# EAGLE design GPS_radiologger_v25_LG77L_CMWX (EAGLE 9.6.2)
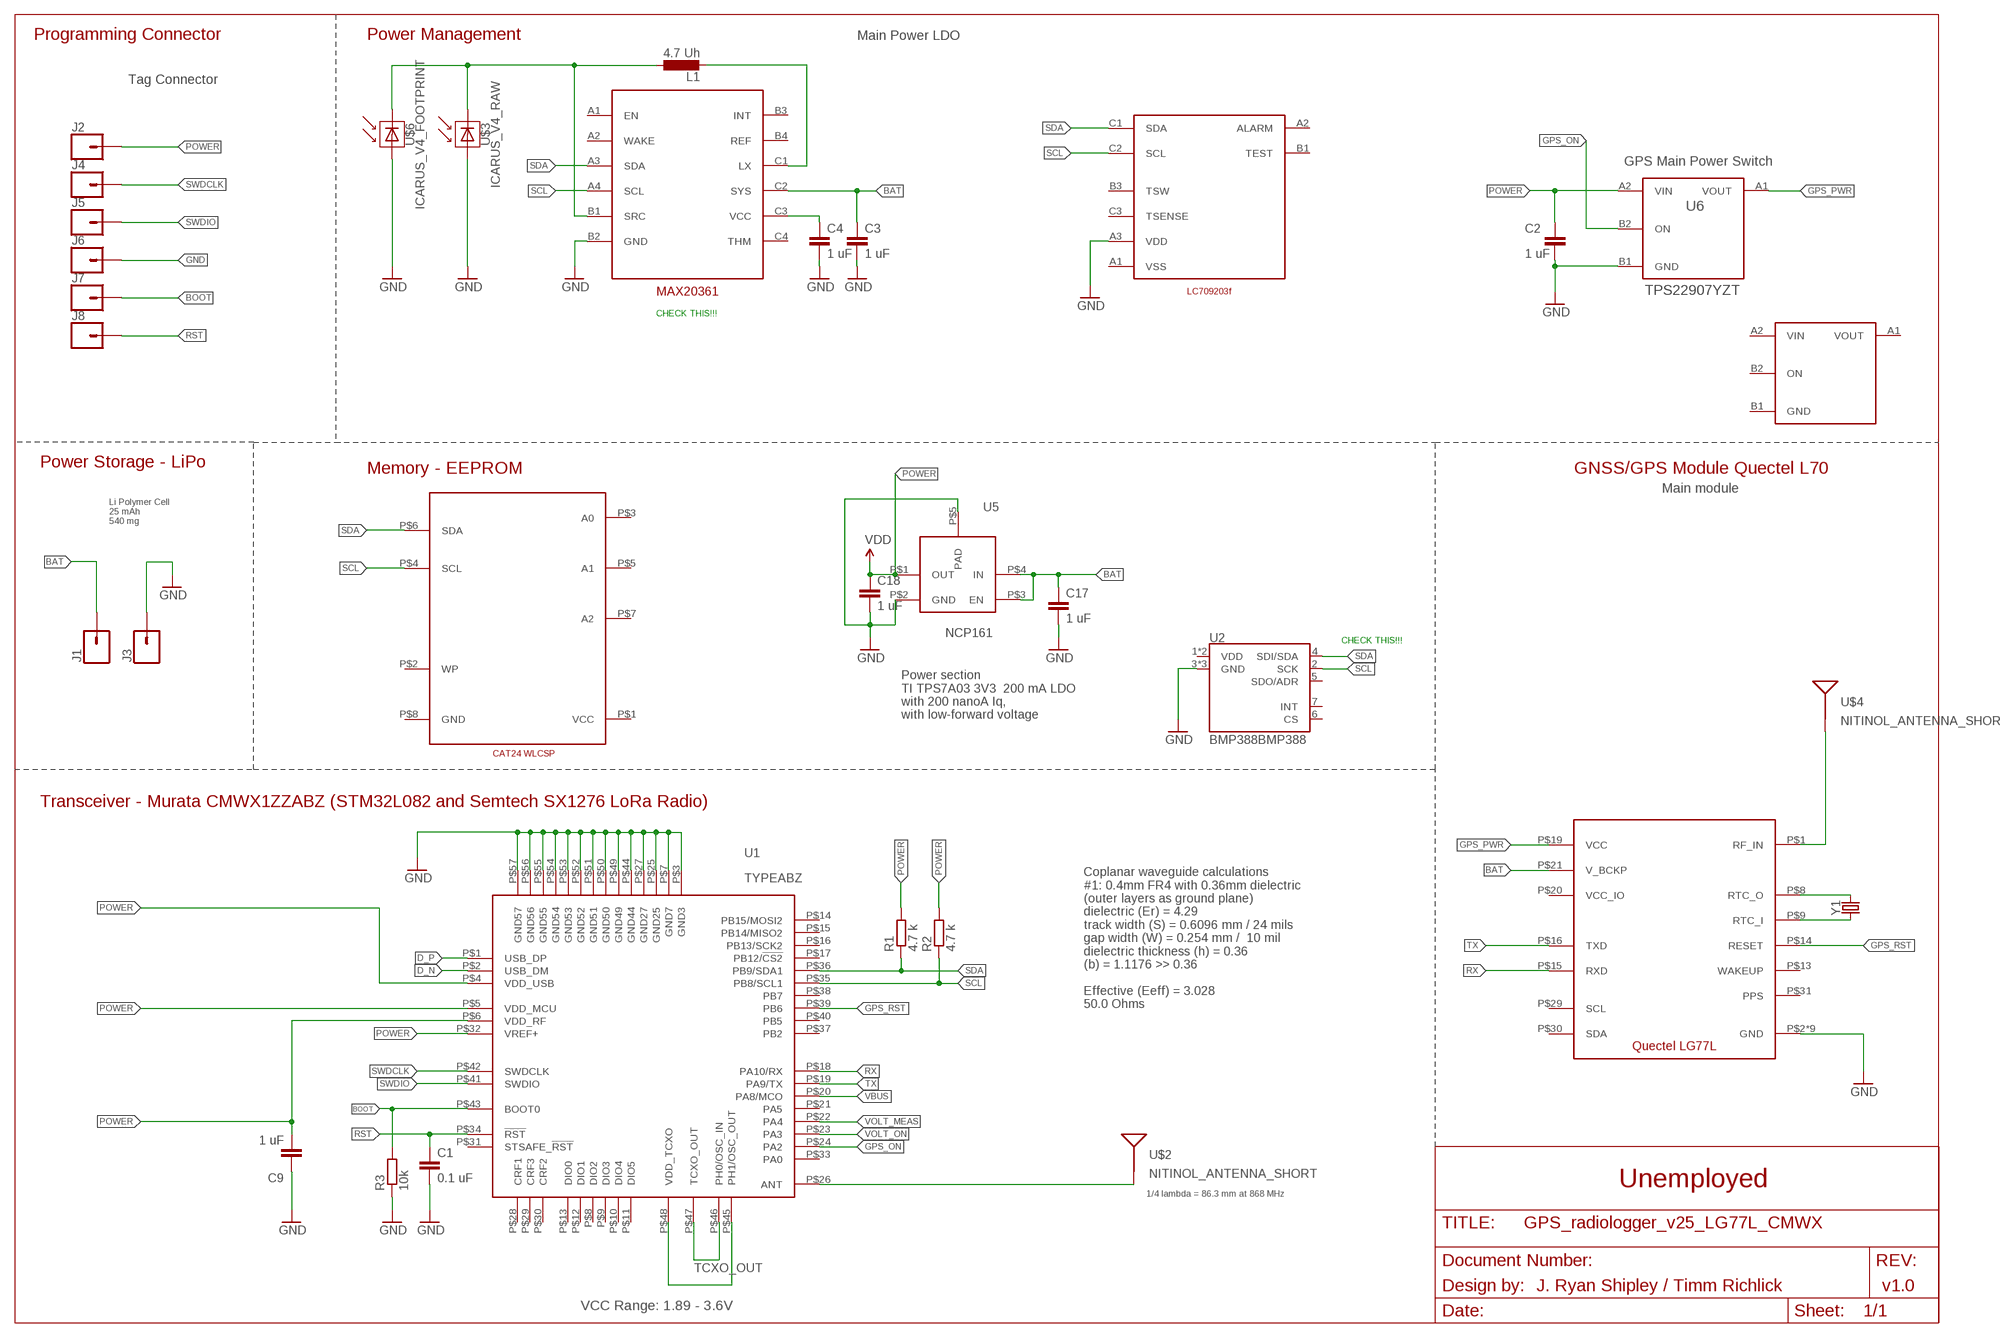
[diagram p0: schematic, sheet 1]

## Parts
C1  0.1 uF  C-EUC0201  [C0201]
C2  1 uF  C-EUC0201  [C0201]
C3  1 uF  C-EUC0201  [C0201]
C4  1 uF  C-EUC0201  [C0201]
C9  1 uF  C-EUC0201  [C0201]
C17  1 uF  0402CAP.KW  [0402-CAP]
C18  1 uF  0402CAP.KW  [0402-CAP]
J1  CONN_01PTH_NO_SILK_SMALL  [1X01_SMALL]
J2  CONN_01PTH_NO_SILK_SMALL  [1X01_SMALL]
J3  CONN_01PTH_NO_SILK_SMALL  [1X01_SMALL]
J4  CONN_01PTH_NO_SILK_SMALL  [1X01_SMALL]
J5  CONN_01PTH_NO_SILK_SMALL  [1X01_SMALL]
J6  CONN_01PTH_NO_SILK_SMALL  [1X01_SMALL]
J7  CONN_01PTH_NO_SILK_SMALL  [1X01_SMALL]
J8  CONN_01PTH_NO_SILK_SMALL  [1X01_SMALL]
L1  4.7 Uh  L-EUL2012C  [L2012C]
R1  4.7 k  R-EU_R0201  [R0201]
R2  4.7 k  R-EU_R0201  [R0201]
R3  10k  R-EU_R0201  [R0201]
U1  TYPEABZ  [TYPEABZ]
U2  BMP388BMP388  [LGA-10(2X2)]
U5  NCP161  [NCP161]
U6  TPS22907YZT  [YFP0004-DSBGA]
U$1  MAX20361  [BGA12N40P4X3_123X163X64N]
U$2  NITINOL_ANTENNA_SHORT  [ICARUS_NITINOL_ANTENNA_SHORT]
U$3  ICARUS_V4_RAW  [ICARUS_FULL_TOP]
U$4  NITINOL_ANTENNA_SHORT  [ICARUS_NITINOL_ANTENNA_SHORT]
U$5  CAT24_WLCSP8  [WLCSP8]
U$6  ICARUS_V4_FOOTPRINT  [ICARUS_FULL_FOOTPRINT]
U$7  LG77L  [LG77L]
U$8  LC709203F  [BGA9N50P3X3_160X175X50N]
U$9  TPS22916CL  [YFP0004-DSBGA]
Y1  CRYSTAL-32.768KHZ  [CRYSTAL-SMD-1.0X1.2MM]

## Nets
BAT [battery]: C3.1 C17.1 J1.P$1 U5.P$3(EN) U5.P$4(IN) U$1.C2(SYS) U$7.P$21(V_BCKP)
BOOT: J7.P$1 R3.2 U1.P$43(BOOT0)
D_N [diff_pair]: U1.P$2(USB_DM)
D_P [diff_pair]: U1.P$1(USB_DP)
GND: C1.2 C2.2 C3.2 C4.2 C9.1 C17.2 C18.2 J3.P$1 J6.P$1 R3.1 U1.P$3(GND3) U1.P$7(GND7) U1.P$25(GND25) U1.P$27(GND27) U1.P$44(GND44) U1.P$49(GND49) U1.P$50(GND50) U1.P$51(GND51) U1.P$52(GND52) U1.P$53(GND53) U1.P$54(GND54) U1.P$55(GND55) U1.P$56(GND56) U1.P$57(GND57) U2.3(GND) U2.8(GND) U2.9(GND) U5.P$2(GND) U5.P$5(PAD) U6.B1(GND) U$1.B2(GND) U$3.P$2(MINUS) U$6.P$2(MINUS) U$7.P$2(GND) U$7.P$18(GND) U$7.P$37(GND) U$7.P$38(GND) U$7.P$39(GND) U$7.P$40(GND) U$7.P$41(GND) U$7.P$42(GND) U$7.P$43(GND) U$8.A3(VDD)
GPS_ON: U1.P$24(PA2) U6.B2(ON)
GPS_PWR: U6.A1(VOUT) U$7.P$19(VCC)
GPS_RST: U1.P$39(PB6) U$7.P$14(RESET)
N$1: U1.P$45(PH1/OSC_OUT) U1.P$48(VDD_TCXO)
N$2 [antenna]: U$4.1(SIGNAL) U$4.2(SIGNAL) U$4.3(SIGNAL) U$7.P$1(RF_IN)
N$3: U$7.P$8(RTC_O) Y1.P$2
N$4: U$7.P$9(RTC_I) Y1.P$1
N$5: L1.2 U$1.C1(LX)
N$6: C4.1 U$1.C3(VCC)
N$11 [antenna]: U1.P$26(ANT) U$2.1(SIGNAL) U$2.2(SIGNAL) U$2.3(SIGNAL)
POWER [power]: C2.1 C9.2 C18.1 J2.P$1 R1.2 R2.2 U1.P$4(VDD_USB) U1.P$5(VDD_MCU) U1.P$6(VDD_RF) U1.P$32(VREF+) U5.P$1(OUT) U6.A2(VIN) ; supply symbol labelled VDD
RST: C1.1 J8.P$1 U1.P$34(!RST)
RX: U1.P$18(PA10/RX) U$7.P$15(RXD)
SCL: R2.1 U1.P$35(PB8/SCL1) U2.2(SCK) U$1.A4(SCL) U$5.P$4(SCL) U$8.C2(SCL)
SDA: R1.1 U1.P$36(PB9/SDA1) U2.4(SDI/SDA) U$1.A3(SDA) U$5.P$6(SDA) U$8.C1(SDA)
SOL_IN [battery]: L1.1 U$1.B1(SRC) U$3.P$1(PLUS) U$6.P$1(PLUS)
SWDCLK: J4.P$1 U1.P$42(SWDCLK)
SWDIO: J5.P$1 U1.P$41(SWDIO)
TCXO_OUT: U1.P$46(PH0/OSC_IN) U1.P$47(TCXO_OUT)
TX: U1.P$19(PA9/TX) U$7.P$16(TXD)
VBUS: U1.P$20(PA8/MCO)
VOLT_MEAS: U1.P$22(PA4)
VOLT_ON: U1.P$23(PA3)
Unconnected: U1.P$8(DIO2) U1.P$9(DIO3) U1.P$10(DIO4) U1.P$11(DIO5) U1.P$12(DIO1) U1.P$13(DIO0) U1.P$14(PB15/MOSI2) U1.P$15(PB14/MISO2) U1.P$16(PB13/SCK2) U1.P$17(PB12/!CS2) U1.P$21(PA5) U1.P$28(CRF1) U1.P$29(CRF3) U1.P$30(CRF2) U1.P$31(STSAFE_!RST) U1.P$33(PA0) U1.P$37(PB2) U1.P$38(PB7) U1.P$40(PB5) U2.1(VDD) U2.5(SDO/ADR) U2.6(CS) U2.7(INT) U2.10(VDD) U$1.A1(EN) U$1.A2(WAKE) U$1.B3(INT) U$1.B4(REF) U$1.C4(THM) U$5.P$1(VCC) U$5.P$2(WP) U$5.P$3(A0) U$5.P$5(A1) U$5.P$7(A2) U$5.P$8(GND) U$7.P$13(WAKEUP) U$7.P$20(VCC_IO) U$7.P$29(SCL) U$7.P$30(SDA) U$7.P$31(PPS) U$8.A1(VSS) U$8.A2(ALARM) U$8.B1(TEST) U$8.B3(TSW) U$8.C3(TSENSE) U$9.A1(VOUT) U$9.A2(VIN) U$9.B1(GND) U$9.B2(ON)

## Notes on the sheet
- Programming Connector | Power Management | Main Power LDO
- Tag Connector
- GPS Main Power Switch
- CHECK THIS!!!
- Power Storage - LiPo
- Memory - EEPROM | GNSS/GPS Module Quectel L70
- Main module
- Li Polymer Cell
  25 mAh
  540 mg
- CHECK THIS!!!
- Power section
  TI TPS7A03 3V3  200 mA LDO
  with 200 nanoA Iq, 
  with low-forward voltage
- Transceiver - Murata CMWX1ZZABZ (STM32L082 and Semtech SX1276 LoRa Radio)
- Coplanar waveguide calculations
  #1: 0.4mm FR4 with 0.36mm dielectric 
  (outer layers as ground plane)
  dielectric (Er) = 4.29
  track width (S) = 0.6096 mm / 24 mils
  gap width (W) = 0.254 mm /  10 mil
  dielectric thickness (h) = 0.36
  (b) = 1.1176 >> 0.36
  
  Effective (Eeff) = 3.028
  50.0 Ohms
- Unemployed
- 1/4 lambda = 86.3 mm at 868 MHz
- Design by: | J. Ryan Shipley / Timm Richlick | v1.0
- VCC Range: 1.89 - 3.6V

## Library data of the parts
C1-C4 C9 = rcl:C-EU: CAPACITOR, European symbol; SPICEPREFIX: C
C17 C18 = SparkFun-Capacitors:0402CAP.KW
J1-J8 = SparkFun-Connectors:CONN_01: Single connection point. Often used as Generic Header-pin footprint for 0.1 inch spaced/style header connections On any of the 0.1 inch spaced packages, you can populate with these: Break Away Headers - Straight <https://www.sparkfun.com/products/116> (PRT-00116) Break Away Male Headers - Right Angle <https://www.sparkfun.com/products/553> (PRT-00553) Female Headers <https://www.sparkfun.com/products/115> (PRT-00115) Break Away Headers - Machine Pin <https://www.sparkfun.com/products/117> (PRT-00117) Break Away Female Headers - Swiss Machine Pin <https://www.sparkfun.com/products/743> (PRT-00743) This device is also useful as a general connection point to wire up your design to another part of your project. Our various solder wires solder well into these plated through hole pads. Hook-Up Wire - Assortment (Stranded, 22 AWG) <https://www.sparkfun.com/products/11375> (PRT-11375) Hook-Up Wire - Assortment (Solid Core, 22 AWG) <https://www.sparkfun.com/products/11367> (PRT-11367) View the entire wire category on our website here <https://www.sparkfun.com/categories/141> Special notes: SMTSO-256-ET is a "flush mount" nut for a 4-40 screw. We mostly use this on specialty testbeds; it is a nice way to connect hardware to your PCB at an adjustable hieght. Also note, the SNAP packages are for using a snappable style connector. We sell a baggie of snaps and they are also used on two LilyPad designs: Snap Assortment - 30 pack (male and female) <https://www.sparkfun.com/products/11347> (DEV-11347) LilyPad Arduino SimpleSnap <https://www.sparkfun.com/products/10941> (DEV-10941) LilyPad SimpleSnap Protoboard <https://www.sparkfun.com/products/10940> (DEV-10940)
L1 = rcl:L-EU: INDUCTOR, European symbol; SPICEPREFIX: L
R1-R3 = rcl:R-EU_: RESISTOR, European symbol; SPICEPREFIX: R
U1 = Kris:TYPEABZ: CMWX1ZZABZ-078
U2 = SparkFun-Sensors:BMP388: Bosch BMP3388 Pressure Sensor Senses pressure from 300 hPa to 1250 hPa, sends data out over I2C or Serial; PROD_ID: IC-14045
U5 = Kris:NCP161: NCP161 3V3 LDO voltage regulator
U6 = TPS22916:TPS22907YZT
U$1 = Ryan_custom:MAX20361
U$2 U$4 = Antenna_mounts:NITINOL_ANTENNA_SHORT
U$3 = TrisolX_Solar_Cells:ICARUS_V4_RAW
U$5 = Ryan_custom:CAT24_WLCSP8
U$6 = TrisolX_Solar_Cells:ICARUS_V4_FOOTPRINT
U$7 = Quectel:LG77L
U$8 = Ryan_custom:LC709203F
U$9 = TPS22916:TPS22916CL
Y1 = SparkFun-Clocks:CRYSTAL-32.768KHZ: 32.768kHz Crystal Frequency: 32.768kHz Frequency Stability: ±20ppm Load Capacitance: 12.5pF (PTH-2X6 & SMD-3.2X1.5), 6pF (SMD-2X6) SparkFun Products: SparkFun BigTime Watch Kit <https://www.sparkfun.com/products/11734> SparkFun nRF52832 Breakout <https://www.sparkfun.com/products/13990> SparkFun Real Time Clock Module <https://www.sparkfun.com/products/12708>

## Net classes
1 power: width 0.152 mm
2 antenna: width 0.254 mm, clearance 0.102 mm
3 battery: width 0.152 mm
4 diff_pair: width 0.178 mm, clearance 0.152 mm

## Board
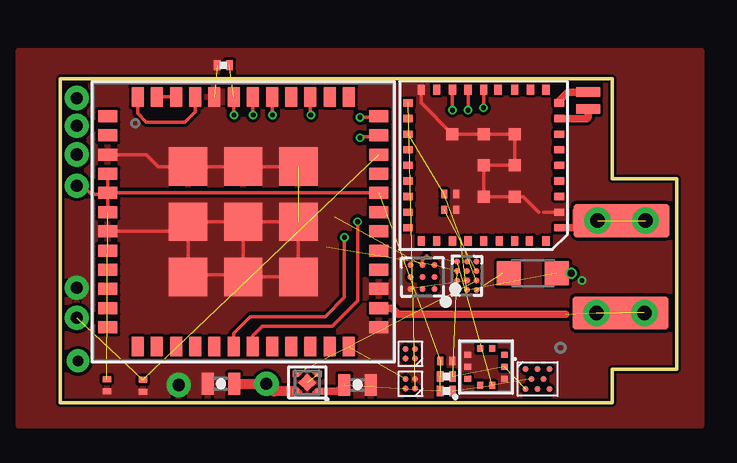
[diagram p1: board, top side]
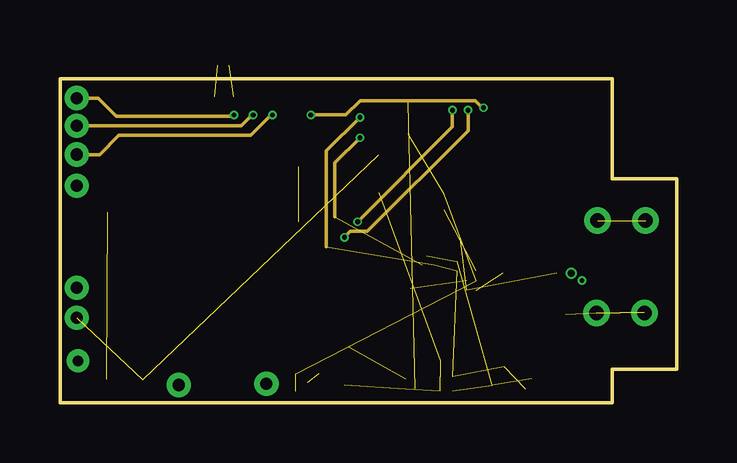
[diagram p2: board, inner layer Route2]
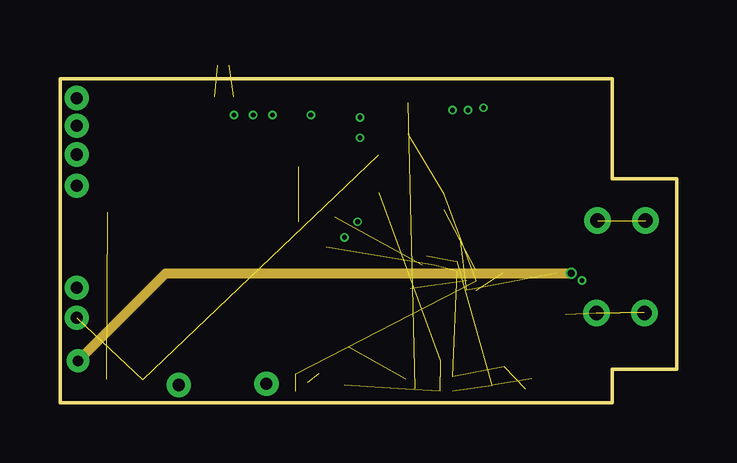
[diagram p3: board, inner layer Route15]
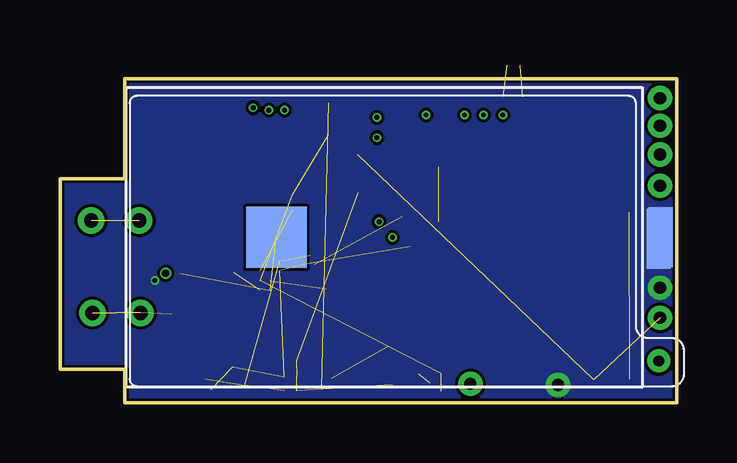
[diagram p4: board, bottom side, seen from below]

Size 25.7 x 13.5 mm. Coordinates in mm from the lower left corner, seen from the top.
Outline: 0,13.5 23,13.5 23,9.35 25.7,9.35 25.7,1.4 23,1.4 23,0 0,0 0,13.5
Copper layers (1*2+15*16): Top 0.035mm / dielectric 0.08mm / Route2 0.035mm / dielectric 0.08mm / Route15 0.035mm / dielectric 0.11mm / Bottom 0.035mm
Design rules "default *": minimum track width 5mil, minimum drill 0.15mm, track to track 5mil, track to pad 5mil, pad to pad 5mil, via to via 5mil, smd to smd 5mil, copper to edge 4mil, drill to drill 4mil, minimum pad ring 10mil, minimum via ring 3mil, stop-mask expansion 0mil, vias tented up to drill 20mil, thermal gap 0mil

### Footprints (pad centres in the part's own frame; a part is rotated, then mirrored left to right if it is on the bottom)
C0201 = smd 0.25 x 0.35: 1 -0.25,0; 2 0.25,0
0402-CAP = smd 0.5 x 0.9: 1 -0.55,0; 2 0.55,0
1X01_SMALL = drill 0.508: P$1 0,0
L2012C = smd 1 x 1: 1 -1,0; 2 1,0
R0201 = smd 0.28 x 0.43: 1 -0.255,0; 2 0.255,0
TYPEABZ = smd 0.8 x 0.5: P$1 -5.65,4.4; P$2 -5.65,3.6; P$3 -5.65,2.8; P$4 -5.65,2; P$5 -5.65,1.2; P$6 -5.65,0.4; P$7 -5.65,-0.4; P$8 -5.65,-1.2; P$9 -5.65,-2; P$10 -5.65,-2.8; P$11 -5.65,-3.6; P$12 -5.65,-4.4; P$25 5.65,-4.4; P$26 5.65,-3.6; P$27 5.65,-2.8; P$28 5.65,-2; P$29 5.65,-1.2; P$30 5.65,-0.4; P$31 5.65,0.4; P$32 5.65,1.2; P$33 5.65,2; P$34 5.65,2.8; P$35 5.65,3.6; P$36 5.65,4.4 | smd 0.5 x 0.8: P$13 -4.4,-5.2; P$14 -3.6,-5.2; P$15 -2.8,-5.2; P$16 -2,-5.2; P$17 -1.2,-5.2; P$18 -0.4,-5.2; P$19 0.4,-5.2; P$20 1.2,-5.2; P$21 2,-5.2; P$22 2.8,-5.2; P$23 3.6,-5.2; P$24 4.4,-5.2; P$37 4.4,5.2; P$38 3.6,5.2; P$39 2.8,5.2; P$40 2,5.2; P$41 1.2,5.2; P$42 0.4,5.2; P$43 -0.4,5.2; P$44 -1.2,5.2; P$45 -2,5.2; P$46 -2.8,5.2; P$47 -3.6,5.2; P$48 -4.4,5.2 | smd 1.6 x 1.6: P$49 -2.3,2.3; P$50 0,2.3; P$51 2.3,2.3; P$52 -2.3,0; P$53 0,0; P$54 2.3,0; P$55 -2.3,-2.3; P$56 0,-2.3; P$57 2.3,-2.3
LGA-10(2X2) = smd 0.25 x 0.275: 1 0.25,0.762; 2 -0.25,0.762; 6 -0.25,-0.762; 7 0.25,-0.762 | smd 0.275 x 0.25: 3 -0.762,0.5; 4 -0.762,0; 5 -0.762,-0.5; 8 0.762,-0.5; 9 0.762,0; 10 0.762,0.5
NCP161 = smd 0.24 x 0.24: P$1 -0.37,-0.48; P$2 0.37,-0.48; P$3 0.37,0.48; P$4 -0.37,0.48 | smd 0.52 x 0.52 rotated 45: P$5 0,0
YFP0004-DSBGA = smd 0.25 x 0.25: A1 0.2,-0.2; A2 -0.2,-0.2; B1 0.2,0.2; B2 -0.2,0.2
BGA12N40P4X3_123X163X64N = smd 0.25 x 0.25: A1 -0.6,0.4; A2 -0.2,0.4; A3 0.2,0.4; A4 0.6,0.4; B1 -0.6,0; B2 -0.2,0; B3 0.2,0; B4 0.6,0; C1 -0.6,-0.4; C2 -0.2,-0.4; C3 0.2,-0.4; C4 0.6,-0.4
ICARUS_NITINOL_ANTENNA_SHORT = smd 4 x 1.4: 1 0,0 | drill 0.6: 2 -1,0; 3 1,0
ICARUS_FULL_TOP = smd 2.54 x 2.54: P$1 0,-4.48 | smd 2.5 x 1: P$2 0,11.538
WLCSP8 = smd 0.24 x 0.24: P$1 -0.5,0.425; P$2 0,0.425; P$3 0.5,0.425; P$4 -0.25,0; P$5 0.25,0; P$6 -0.5,-0.425; P$7 0,-0.425; P$8 0.5,-0.425
ICARUS_FULL_FOOTPRINT = drill 0.45: P$1 5,11.5 | smd 2.5 x 1: P$2 -0.1,11.5
LG77L = smd 0.4 x 0.3 bottom: P$1 3.15,2.6; P$2 3.15,1.95; P$3 3.15,1.3; P$4 3.15,0.65; P$5 3.15,0; P$6 3.15,-0.65; P$7 3.15,-1.3; P$8 3.15,-1.95; P$9 3.15,-2.6; P$19 -3.15,-2.6; P$20 -3.15,-1.95; P$21 -3.15,-1.3; P$22 -3.15,-0.65; P$23 -3.15,0; P$24 -3.15,0.65; P$25 -3.15,1.3; P$26 -3.15,1.95; P$27 -3.15,2.6 | smd 0.3 x 0.4 bottom: P$10 2.6,-3.15; P$11 1.95,-3.15; P$12 1.3,-3.15; P$13 0.6,-3.15; P$14 0,-3.15; P$15 -0.65,-3.15; P$16 -1.3,-3.15; P$17 -1.95,-3.15; P$18 -2.6,-3.15; P$28 -2.6,3.15; P$29 -1.95,3.15; P$30 -1.3,3.15; P$31 -0.65,3.15; P$32 0,3.15; P$33 0.65,3.15; P$34 1.3,3.15; P$35 1.9,3.15; P$36 2.6,3.15 | smd 0.5 x 0.5 bottom: P$37 0,0; P$38 0,1.3; P$39 1.3,1.3; P$40 1.3,0; P$41 1.3,-1.3; P$42 0,-1.3; P$43 -1.3,-1.3
BGA9N50P3X3_160X175X50N = smd 0.25 x 0.25: A1 -0.5,0.5; A2 0,0.5; A3 0.5,0.5; B1 -0.5,0; B2 0,0; B3 0.5,0; C1 -0.5,-0.5; C2 0,-0.5; C3 0.5,-0.5
CRYSTAL-SMD-1.0X1.2MM = smd 0.4 x 1: P$1 0.35,0; P$2 -0.35,0

### Placement (x,y rotation side)
C1  3.46,0.71 270 top
C2  16.1,1.75 0 top
C3  16.25,8.7 0 top
C4  16.25,8.05 0 top
C9  1.95,0.74 90 top
C17  6.7,0.8 180 top
C18  12.4,0.75 0 top
J1  8.6,0.8 0 top
J2  0.7,9.05 0 top
J3  0.7,4.8 0 top
J4  0.7,11.55 0 top
J5  0.7,10.35 0 top
J6  4.95,0.75 0 top
J7  0.7,12.7 0 top
J8  0.7,3.55 0 top
L1  19.7,5.4 180 top
R1  16.1,1.1 180 top
R2  16.1,0.5 180 top
R3  6.8,14.07 0 top
U1  7.64,7.55 0 top
U2  17.75,1.5 180 top
U5  10.3,0.85 90 top
U6  14.6,0.8 0 top
U$1  16.95,5.3 90 top
U$2  23.35,3.75 0 top
U$3  12.2,6.9 270 bottom
U$4  23.4,7.6 180 top
U$5  19.9,1 0 top
U$6  12.25,6.75 270 bottom
U$7  17.65,9.9 180 bottom
U$8  15.1,5.25 180 top
U$9  14.6,2.05 0 top
Y1  22,12.6 90 top

### Tracks (layer width: path | path; a pad name or v marks a point on that pad's centre or on a via)
BAT  (4 unrouted)
  Top 0.305: C17.1 | U5.P$4 9.77,0.48
  Top 0.406: C17.1 J1.P$1 8.92,0.48 U5.P$4
BOOT  (via drill 0.2)  (1 unrouted)
  Top 0.152: v7.25,12 7.24,12.01 U1.P$43
  Route2 0.152: J7.P$1 1.6,12.7 2.35,11.95 7.2,11.95 v7.25,12
GND  (via drill 0.2)  (4 unrouted)
  Top 0.152: U1.P$51 U1.P$50 U1.P$49 4.1,9.85 3.6,10.35 U1.P$3 | U1.P$52 U1.P$53 | U1.P$53 U1.P$54 U1.P$57 U1.P$56 | U1.P$55 5.34,5.35 | 5.34,5.35 5.34,7.04 5.35,7.05 5.35,7.54 U1.P$52 | U1.P$53 U1.P$56 | U1.P$56 7.54,5.35 5.34,5.35 | U1.P$52 4.94,7.15 U1.P$7 | 20.15,7.95 U$7.P$2 | 19.95,7.95 19.3,8.6 U$7.P$39 U$7.P$38 U$7.P$37 U$7.P$40 U$7.P$41 U$7.P$42 U$7.P$43 15.05,12.5 U$7.P$18
  other vias: 21.75,5.1
  pour Top: -1.71,14.68 26.71,14.68 26.71,-0.95 -1.71,-0.95
  pour Bottom: -1.85,15.15 27.3,15.15 27.3,-1.65 -1.85,-1.65
GPS_ON  (1 unrouted)
GPS_PWR  (1 unrouted)
GPS_RST  (via drill 0.2)
  Top 0.152: U1.P$39 10.44,12.11 10.45,12.1 v10.45,12 | v17.65,12.3 U$7.P$14
  Route2 0.152: v17.65,12.3 17.6,12.3 17.3,12.6 12.5,12.6 11.9,12 v10.45,12
N$1
  Top 0.152: U1.P$45 5.64,12.14 5.2,11.7 3.6,11.7 3.24,12.06 U1.P$48
N$2  (2 unrouted)
  Top 0.305: U$4.3 22,8 21.5,8 21.5,7.3 U$7.P$1
N$3
  Top 0.305: U$7.P$8 21.95,11.85 22,11.9 Y1.P$2
N$4
  Top 0.305: U$7.P$9 20.8,12.6 21.15,12.95 Y1.P$1
N$5  (1 unrouted)
  Top 0.152: L1.2 18.46,5.43
N$6  (1 unrouted)
N$11  (3 unrouted)
  Top 0.305: 21.07,3.7 14.09,3.7 13.84,3.95 U1.P$26
POWER  (6 unrouted)
  Top 0.152: U1.P$32 U1.P$5 | U1.P$5 1.99,8.7 | 1.99,8.7 U1.P$6 | U1.P$5 U1.P$4 | J2.P$1 0.95,9.05 1.3,8.7 1.99,8.7
  Top 0.305: C18.1 11.61,0.51 11.55,0.5 11.53,0.48 U5.P$1
RST  (2 unrouted)
RX  (via drill 0.2)
  Top 0.152: U1.P$18 7.24,2.9 7.94,3.6 11.05,3.6 11.85,4.4 v11.85,6.9 | v17,12.2 U$7.P$15
  Route2 0.152: v11.85,6.9 12.1,7.15 12.8,7.15 17,11.35 v17,12.2
SCL  (via drill 0.2)  (5 unrouted)
  Top 0.152: U$1.A4 16.48,5.9 | U$8.C2 15.1,5.95 15.28,6.13 | U1.P$35 13.24,11.1 12.55,11.1 v12.5,11.05
  Route2 0.152: v12.5,11.05 11.45,10 11.45,7.75
SDA  (via drill 0.2)  (5 unrouted)
  Top 0.152: U1.P$36 13.24,11.9 v12.5,11.9
  Route2 0.152: v12.5,11.9 11.1,10.5 11.1,6.5
SOL_IN  (via drill 0.3)  (2 unrouted)
  Top 0.406: v21.3,5.4 L1.1
  Route15 0.406: U$6.P$1 4.4,5.4 v21.3,5.4
SWDCLK  (via drill 0.2)
  Top 0.152: v8.05,12 8.04,12.01 U1.P$42
  Route2 0.152: J4.P$1 7.55,11.55 8,12 v8.05,12
SWDIO  (via drill 0.2)
  Top 0.152: v8.85,12 8.84,12.01 U1.P$41
  Route2 0.152: J5.P$1 1.65,10.35 2.45,11.15 7.95,11.15 8.8,12 v8.85,12
TCXO_OUT
  Top 0.152: U1.P$47 U1.P$46
TX  (via drill 0.2)
  Top 0.152: U1.P$19 8.04,2.8 8.44,3.2 11.35,3.2 12.4,4.25 v12.4,7.55 | v16.35,12.2 U$7.P$16
  Route2 0.152: v16.35,12.2 16.35,11.5 v12.4,7.55